# Altium schematic sheet TOP.SchDoc
size A4; SheetNumber: 1; SheetTotal: 7
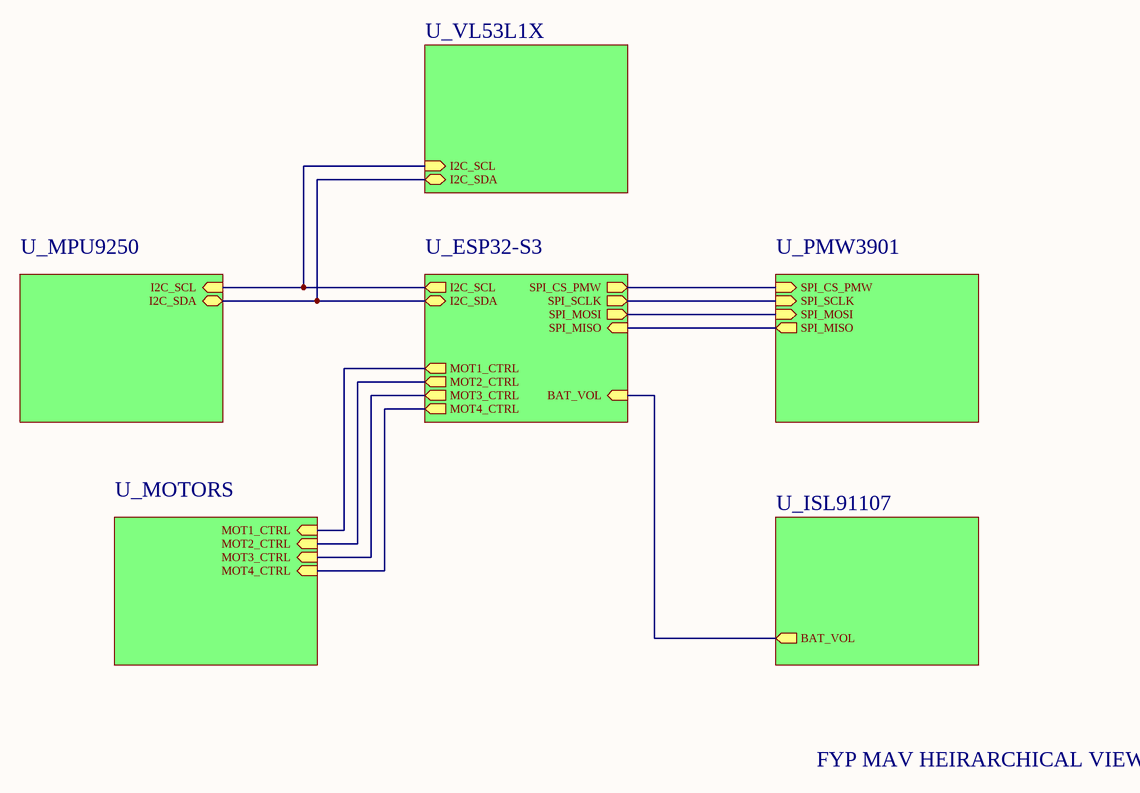
[diagram p0: TOP.SchDoc]

## Sub-sheets
U_ESP32-S3 = ESP32-S3.SchDoc: I2C_SDA (bidir), I2C_SCL (out), SPI_CS_PMW (out), SPI_MISO (in), SPI_SCLK (out), SPI_MOSI (out), BAT_VOL (in), MOT2_CTRL (out), MOT1_CTRL (out), MOT4_CTRL (out), MOT3_CTRL (out)
U_ISL91107 = ISL91107.SchDoc: BAT_VOL (out)
U_MOTORS = motors.SchDoc: MOT1_CTRL (in), MOT2_CTRL (in), MOT3_CTRL (in), MOT4_CTRL (in)
U_MPU9250 = MPU9250.schdoc: I2C_SCL (in), I2C_SDA (bidir)
U_PMW3901 = PMW3901.SchDoc: SPI_CS_PMW (in), SPI_MISO (out), SPI_SCLK (in), SPI_MOSI (in)
U_VL53L1X = VL53L1X.SchDoc: I2C_SDA (bidir), I2C_SCL (in)

## Nets
(unnamed): sheet U_ESP32-S3/I2C_SDA, sheet U_MPU9250/I2C_SDA, sheet U_VL53L1X/I2C_SDA
(unnamed): sheet U_ESP32-S3/I2C_SCL, sheet U_MPU9250/I2C_SCL, sheet U_VL53L1X/I2C_SCL
(unnamed): sheet U_ESP32-S3/SPI_CS_PMW, sheet U_PMW3901/SPI_CS_PMW
(unnamed): sheet U_ESP32-S3/SPI_MISO, sheet U_PMW3901/SPI_MISO
(unnamed): sheet U_ESP32-S3/SPI_SCLK, sheet U_PMW3901/SPI_SCLK
(unnamed): sheet U_ESP32-S3/SPI_MOSI, sheet U_PMW3901/SPI_MOSI
(unnamed): sheet U_ESP32-S3/BAT_VOL, sheet U_ISL91107/BAT_VOL
(unnamed): sheet U_ESP32-S3/MOT2_CTRL, sheet U_MOTORS/MOT2_CTRL
(unnamed): sheet U_ESP32-S3/MOT1_CTRL, sheet U_MOTORS/MOT1_CTRL
(unnamed): sheet U_ESP32-S3/MOT4_CTRL, sheet U_MOTORS/MOT4_CTRL
(unnamed): sheet U_ESP32-S3/MOT3_CTRL, sheet U_MOTORS/MOT3_CTRL

## Notes on the sheet
- FYP MAV HEIRARCHICAL VIEW